# EAGLE design User Interface (EAGLE 8.3.2)
CNAME: KBOT; CREVISION: 2.0; DESIGNER: Y. LABBE & O. LEVEQUE
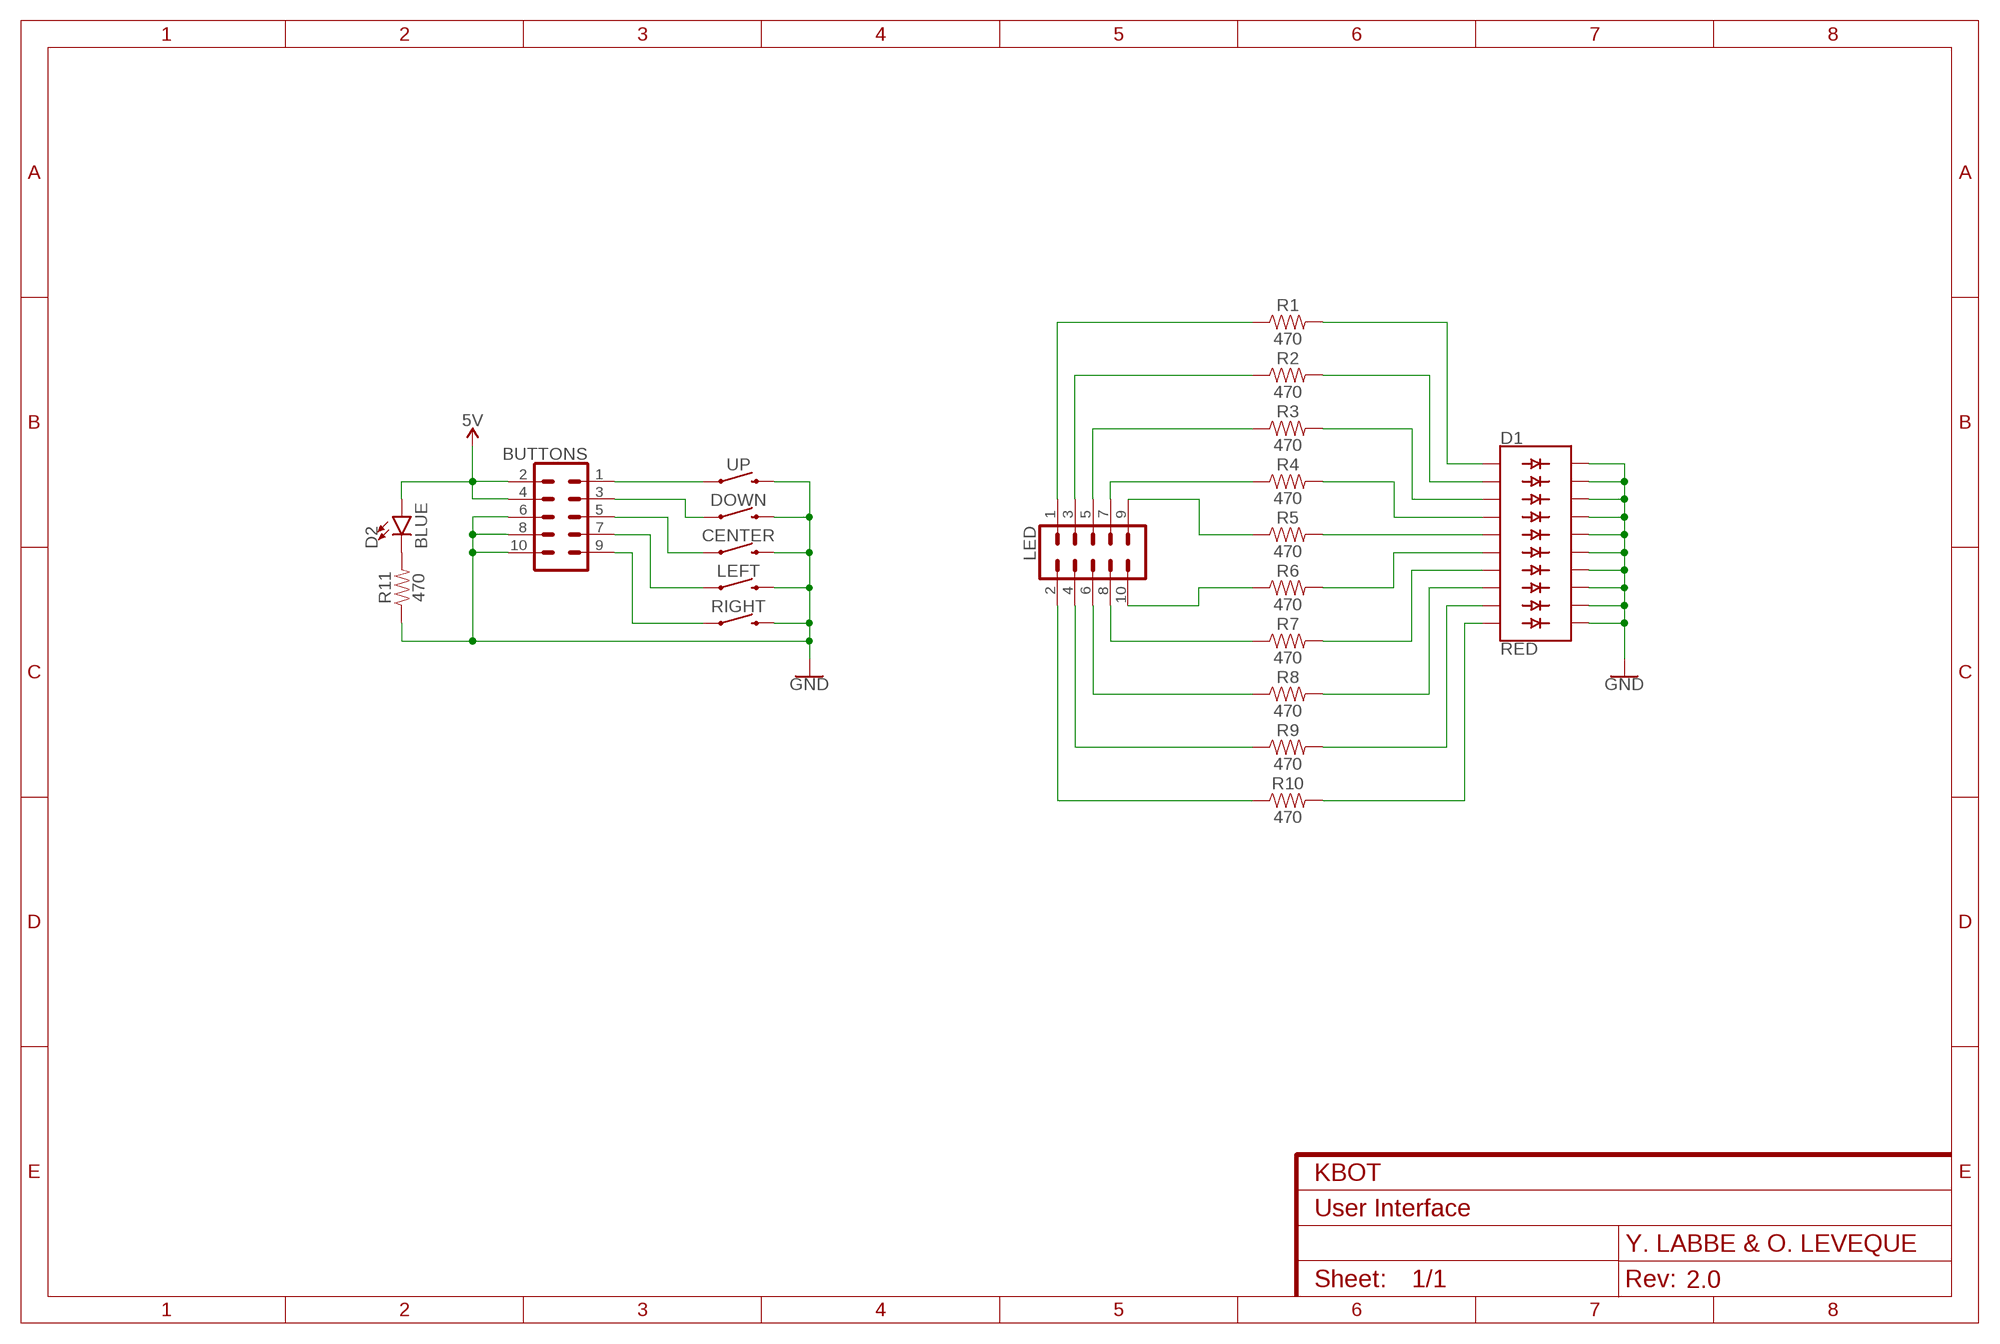
[diagram p0: schematic, sheet 1]

## Parts
BUTTONS  CONN_05X2SHD  [2X5-SHROUDED]
CENTER  MOMENTARY-SWITCH-SPST-PTH-6.0MM  [TACTILE_SWITCH_PTH_6.0MM]
D1  RED  LED_BARGRAPH_10RED  [LED_BARGRAPH_10]
D2  BLUE  LED-BLUE1206  [LED-1206]
DOWN  MOMENTARY-SWITCH-SPST-PTH-6.0MM  [TACTILE_SWITCH_PTH_6.0MM]
LED  CONN_05X2SHD  [2X5-SHROUDED]
LEFT  MOMENTARY-SWITCH-SPST-PTH-6.0MM  [TACTILE_SWITCH_PTH_6.0MM]
R1  470  RESISTOR1206  [1206]
R2  470  RESISTOR1206  [1206]
R3  470  RESISTOR1206  [1206]
R4  470  RESISTOR1206  [1206]
R5  470  RESISTOR1206  [1206]
R6  470  RESISTOR1206  [1206]
R7  470  RESISTOR1206  [1206]
R8  470  RESISTOR1206  [1206]
R9  470  RESISTOR1206  [1206]
R10  470  RESISTOR1206  [1206]
R11  470  RESISTOR1206  [1206]
RIGHT  MOMENTARY-SWITCH-SPST-PTH-6.0MM  [TACTILE_SWITCH_PTH_6.0MM]
UP  MOMENTARY-SWITCH-SPST-PTH-6.0MM  [TACTILE_SWITCH_PTH_6.0MM]

## Nets
5V: BUTTONS.2 BUTTONS.4 D2.A
GND: BUTTONS.6 BUTTONS.8 BUTTONS.10 CENTER.3 D1.11(C9) D1.12(C8) D1.13(C7) D1.14(C6) D1.15(C5) D1.16(C4) D1.17(C3) D1.18(C2) D1.19(C1) D1.20(C) DOWN.3 LEFT.3 R11.1 RIGHT.3 UP.3
N$1: D1.1(A) R1.2
N$2: D1.2(A1) R2.2
N$3: D1.3(A2) R3.2
N$4: D1.4(A3) R4.2
N$5: D1.5(A4) R5.2
N$6: D1.6(A5) R6.2
N$7: D1.7(A6) R7.2
N$8: D1.8(A7) R8.2
N$9: D1.9(A8) R9.2
N$10: D1.10(A9) R10.2
N$11: LED.9 R5.1
N$12: LED.7 R4.1
N$13: LED.5 R3.1
N$14: LED.3 R2.1
N$15: LED.1 R1.1
N$16: LED.10 R6.1
N$17: LED.8 R7.1
N$18: LED.6 R8.1
N$19: LED.4 R9.1
N$20: LED.2 R10.1
N$21: BUTTONS.1 UP.1
N$22: BUTTONS.3 DOWN.1
N$23: BUTTONS.5 CENTER.1
N$24: BUTTONS.7 LEFT.1
N$25: BUTTONS.9 RIGHT.1
N$28: D2.C R11.2

## Library data of the parts
BUTTONS LED = SparkFun-Connectors:CONN_05X2: Multi connection point. Often used as Generic Header-pin footprint for 0.1 inch spaced/style header connections For AVR SPI programming port, see special device with nice symbol: "AVR_SPI_PROG_5x2.dev" You can populate with any combo of single row headers, but if you'd like an exact match, check these: 2x5 AVR ICSP Male Header <https://www.sparkfun.com/products/778> (PRT-00778) 2x5 Pin Shrouded Header <https://www.sparkfun.com/products/8506> (PRT-08506) On any of the 0.1 inch spaced packages, you can populate with these: Break Away Headers - Straight <https://www.sparkfun.com/products/116> (PRT-00116) Break Away Male Headers - Right Angle <https://www.sparkfun.com/products/553> (PRT-00553) Female Headers <https://www.sparkfun.com/products/115> (PRT-00115) Break Away Headers - Machine Pin <https://www.sparkfun.com/products/117> (PRT-00117) Break Away Female Headers - Swiss Machine Pin <https://www.sparkfun.com/products/743> (PRT-00743) Special note: the shrouded connector mates well with our 5x2 ribbon cables: 2x5 Pin IDC Ribbon Cable <https://www.sparkfun.com/products/8535> (PRT-08535); PROD_ID: CONN-08671; SF_ID: PRT-08506
CENTER DOWN LEFT RIGHT UP = SparkFun-Switches:MOMENTARY-SWITCH-SPST: Momentary Switch (Pushbutton) - SPST Normally-open (NO) SPST momentary switches (buttons, pushbuttons). Variants PTH-12MM - 12mm square, through-hole Momentary Pushbutton Switch - 12mm Square <https://www.sparkfun.com/products/9190> (COM-09190) PTH-6.0MM, PTH-6.0MM-KIT - 6.0mm square, through-hole Mini Pushbutton Switch <https://www.sparkfun.com/products/97> (COM-00097) KIT package intended for soldering kit's - only one side of pads' copper is exposed. PTH-RIGHT-ANGLE-KIT - Right-angle, through-hole Right Angle Tactile Button <https://www.sparkfun.com/products/10791> - Used on SparkFun BigTime Watch Kit <https://www.sparkfun.com/products/11734> SMD-12MM - 12mm square, surface-mount Tactile Button - SMD (12mm) <https://www.sparkfun.com/products/12993> (COM-12993) Used on SparkFun PicoBoard <https://www.sparkfun.com/products/11888> SMD-4.5MM - 4.5mm Square Trackball Switch Used on SparkFun Blackberry Trackballer Breakout <https://www.sparkfun.com/products/13169> SMD-4.6MMX2.8MM - 4.60mm x 2.80mm, surface mount Used on SparkFun SAMD21 Mini Breakout <https://www.sparkfun.com/products/13664> SMD-5.2MM, SMD-5.2-REDUNDANT - 5.2mm square, surface-mount Mini Pushbutton Switch - SMD <https://www.sparkfun.com/products/8720> (COM-08720) Used on Arduino Pro Mini <https://www.sparkfun.com/products/11114> REDUNDANT package connects both switch circuits together SMD-6.0X3.5MM - 6.0 x 3.5mm, surface mount Momentary Reset Switch SMD <https://www.sparkfun.com/products/8229> (COM-08229) SMD-6.2MM-TALL - 6.2mm square, surface mount Tactile Button - SMD (6mm) <https://www.sparkfun.com/products/12992> Used on SparkFun Digital Sandbox <https://www.sparkfun.com/products/12651> SMD-RIGHT-ANGLE - Right-angle, surface mount Used on SparkFun Block for Intel® Edison - Arduino <https://www.sparkfun.com/products/13036>; PROD_ID: SWCH-08441; SF_SKU: COM-00097
D1 = SparkFun-LED:LED_BARGRAPH_10: Young Sun LED Tech - YSLB-10251G5-10 10-Segment LED Bar Graph Features: Red Vf = 2.1V, Ifmax = 20mA Yellow Vf = 2.1V, Ifmax = 20mA Blue Vf = 3.4V, Ifmax = 20mA Green Vf = 3.4V, Ifmax = 20mA SparkFun Products: Red <https://www.sparkfun.com/products/9935> Yellow <https://www.sparkfun.com/products/9936> Green <https://www.sparkfun.com/products/9938> Blue <https://www.sparkfun.com/products/9937>; PROD_ID: DIO-10615
D2 = SparkFun-LED:LED-BLUE: Blue SMD LED Used in manufacturing of various products at SparkFun Packages: 0603 - SMD 0603 package [Product Link] <http://www.digikey.com/product-detail/en/SMLE12BC7TT86/511-1589-2-ND/1641808> 1206 - SMD1206 package [Product Link] <http://www.digikey.com/product-detail/en/lite-on-inc/LTST-C150TBKT/160-1643-1-ND/573584> SparkFun Products: ESP8266 Thing-Dev Board <https://www.sparkfun.com/products/13711> RedBoard <https://www.sparkfun.com/products/12757>; PROD_ID: DIO-09911
R1-R11 = SparkFun-Resistors:RESISTOR: Generic Resistor Package

## Board
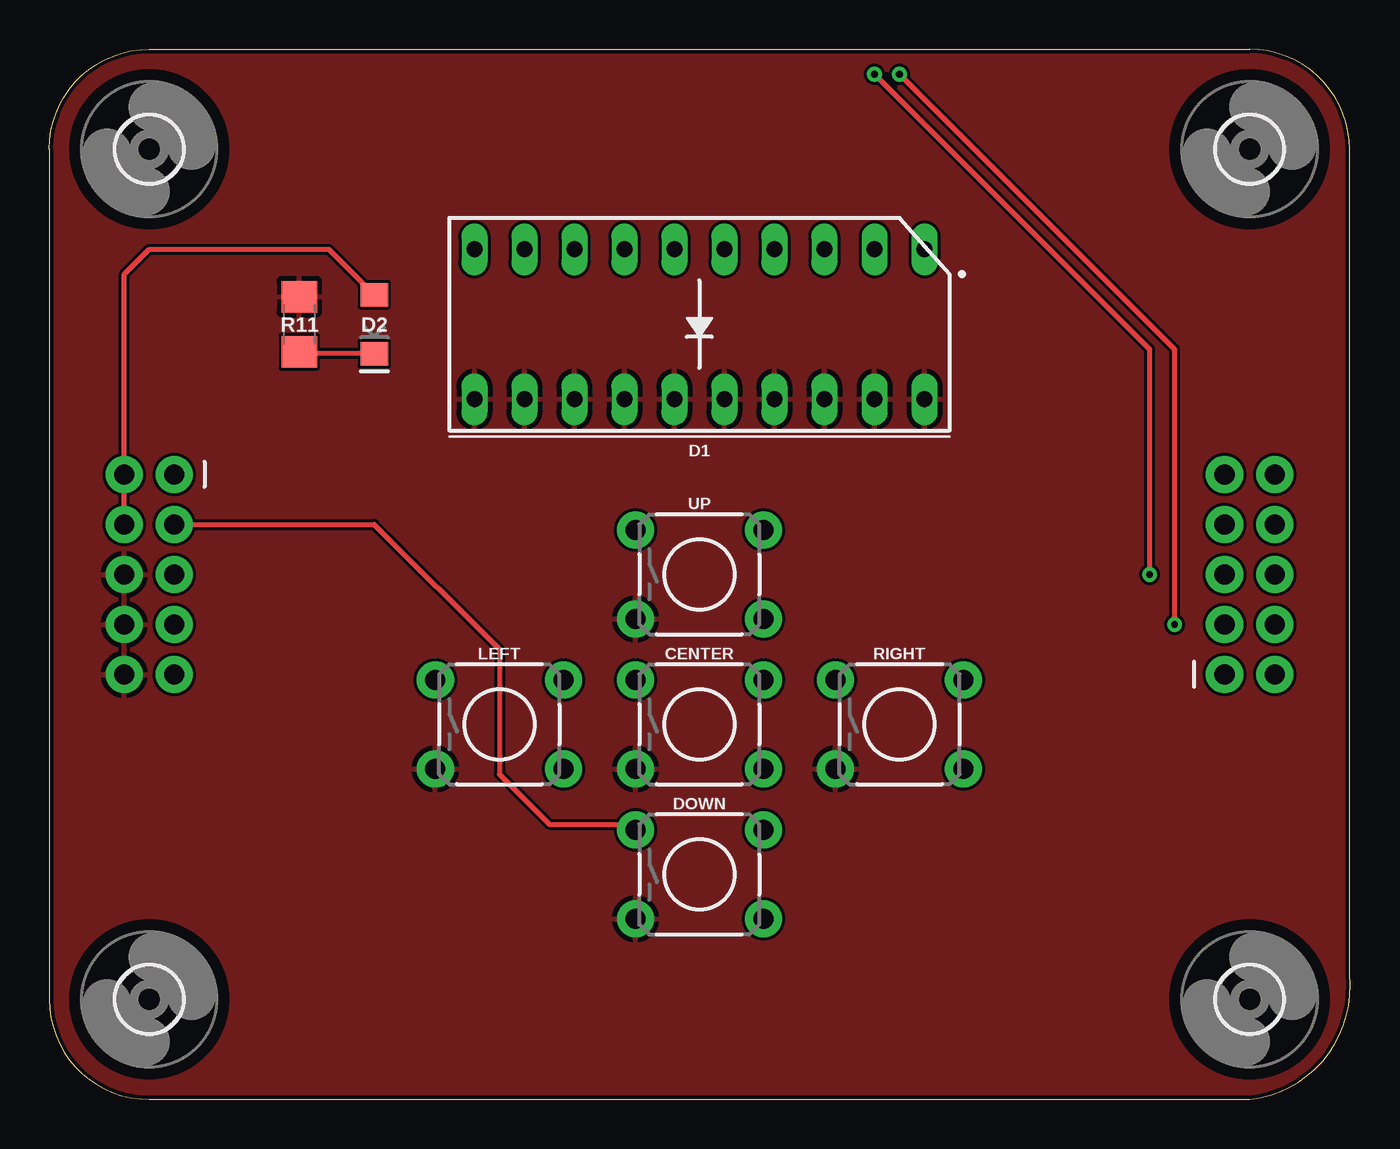
[diagram p1: board, top side]
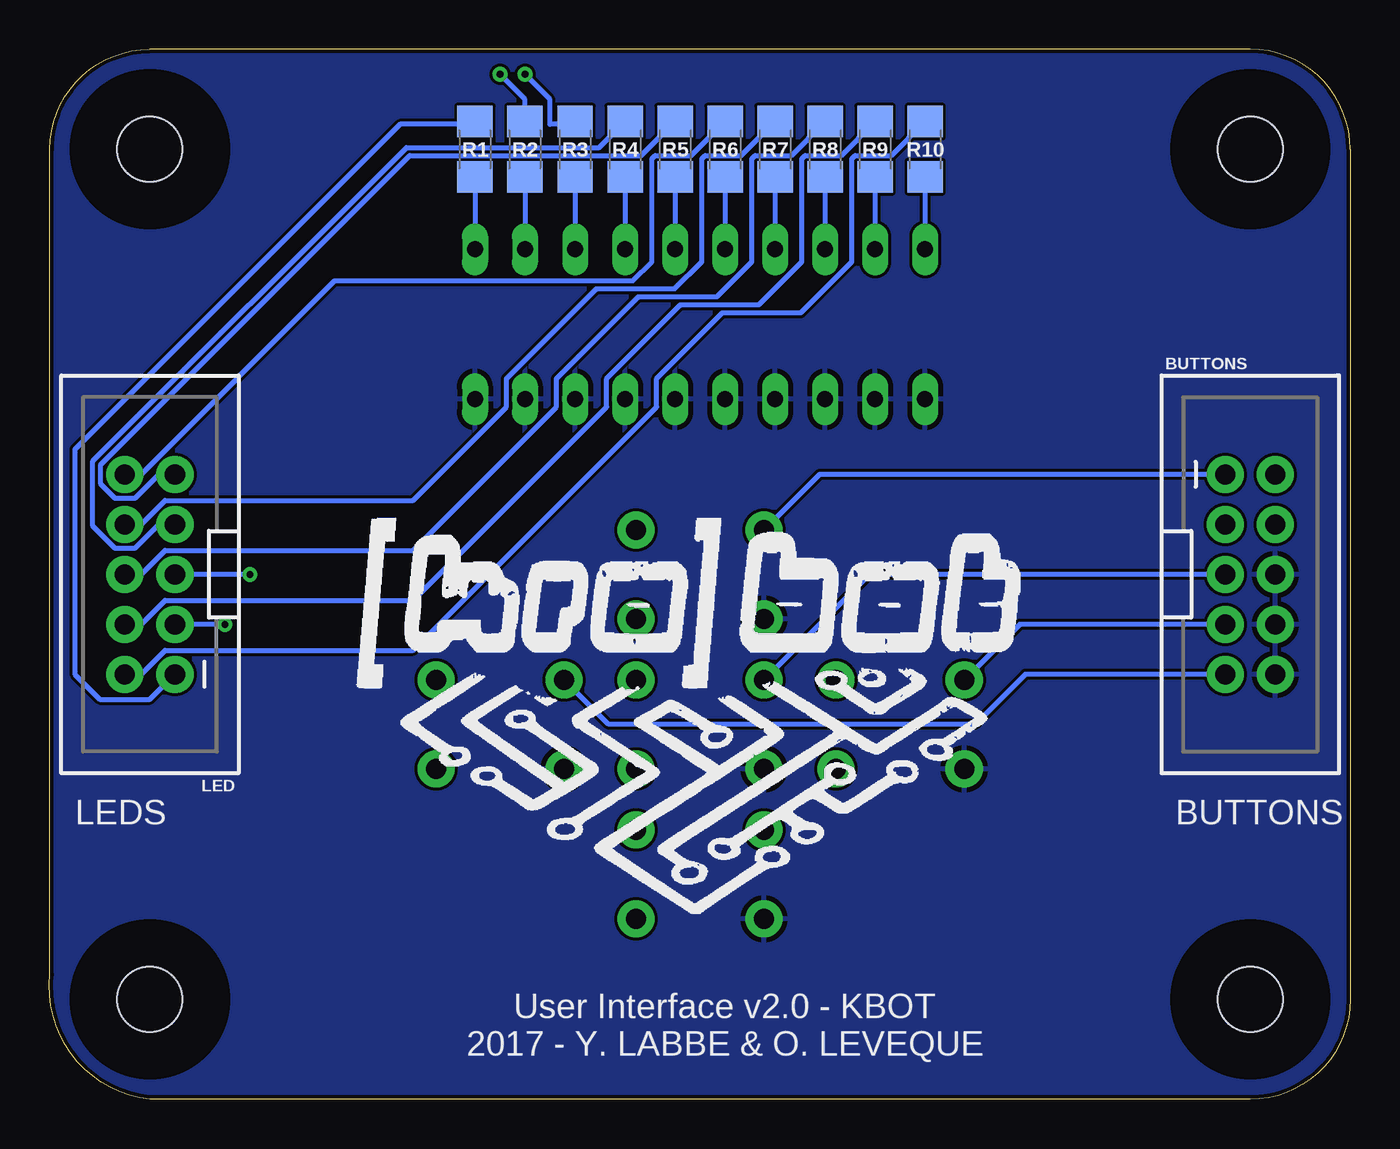
[diagram p2: board, bottom side, seen from below]

Size 66.07 x 53.34 mm. Coordinates in mm from the lower left corner, seen from the top.
Outline: 5.08,0 60.96,0 arc90 66.04,6.35 66.04,48.26 arc90 60.96,53.34 5.08,53.34 arc90 0,48.26 0,5.08 arc90 5.08,0
Copper layers (1*16): Top 0.035mm / dielectric 1.5mm / Bottom 0.035mm
Design rules "default *": minimum track width 6mil, minimum drill 12mil, track to track 6mil, track to pad 6mil, pad to pad 6mil, via to via 6mil, smd to smd 6mil, copper to edge 8mil, drill to drill 6mil, minimum pad ring 10mil, minimum via ring 8mil, stop-mask expansion 4mil, vias tented up to drill 0mil, thermal gap 10mil

### Footprints (pad centres in the part's own frame; a part is rotated, then mirrored left to right if it is on the bottom)
2X5-SHROUDED = drill 1.016 pad 1.88: 1 -1.27,5.08; 2 1.27,5.08; 3 -1.27,2.54; 4 1.27,2.54; 5 -1.27,0; 6 1.27,0; 7 -1.27,-2.54; 8 1.27,-2.54; 9 -1.27,-5.08; 10 1.27,-5.08
TACTILE_SWITCH_PTH_6.0MM = drill 1.016 pad 1.88: 1 -3.251,2.261; 2 3.251,2.261; 3 -3.251,-2.261; 4 3.251,-2.261
LED_BARGRAPH_10 = drill 0.813 long: 1 -11.43,-3.81; 2 -8.89,-3.81; 3 -6.35,-3.81; 4 -3.81,-3.81; 5 -1.27,-3.81; 6 1.27,-3.81; 7 3.81,-3.81; 8 6.35,-3.81; 9 8.89,-3.81; 10 11.43,-3.81; 11 11.43,3.81; 12 8.89,3.81; 13 6.35,3.81; 14 3.81,3.81; 15 1.27,3.81; 16 -1.27,3.81; 17 -3.81,3.81; 18 -6.35,3.81; 19 -8.89,3.81; 20 -11.43,3.81
LED-1206 = smd 1.2 x 1.4: A -1.5,0; C 1.5,0
1206 = smd 1.6 x 1.8: 1 -1.4,0; 2 1.4,0
3,3 = hole 3.3: 0,0

### Placement (x,y rotation side)
BUTTONS  5.08,26.67 0 bottom
CENTER  33.02,19.05 0 top
D1  33.02,39.37 180 top
D2  16.51,39.37 270 top
DOWN  33.02,11.43 0 top
LED  60.96,26.67 180 bottom
LEFT  22.86,19.05 0 top
R1  44.45,48.26 270 bottom
R2  41.91,48.26 270 bottom
R3  39.37,48.26 270 bottom
R4  36.83,48.26 270 bottom
R5  34.29,48.26 270 bottom
R6  31.75,48.26 270 bottom
R7  29.21,48.26 270 bottom
R8  26.67,48.26 270 bottom
R9  24.13,48.26 270 bottom
R10  21.59,48.26 270 bottom
R11  12.7,39.37 270 top
RIGHT  43.18,19.05 0 top
U$1  [3,3]  5.08,5.08 0 top
U$2  [3,3]  60.96,5.08 0 top
U$3  [3,3]  5.08,48.26 0 top
U$4  [3,3]  60.96,48.26 0 top
U$5  [LOGO_33MM]  33.02,20.32 0 bottom
UP  33.02,26.67 0 top

### Tracks (layer width: path | path; a pad name or v marks a point on that pad's centre or on a via)
5V
  Top 0.254: BUTTONS.4 BUTTONS.2 3.81,41.91 5.08,43.18 14.2,43.18 D2.A
GND
  pour Top: 0,0 0,53.34 66.04,53.34 66.04,0
  pour Bottom: 0,0 0,53.34 66.04,53.34 66.04,0
N$1
  Bottom 0.254: R1.2 D1.1
N$2
  Bottom 0.254: R2.2 D1.2
N$3
  Bottom 0.254: R3.2 D1.3
N$4
  Bottom 0.254: R4.2 D1.4
N$5
  Bottom 0.254: R5.2 D1.5
N$6
  Bottom 0.254: R6.2 D1.6
N$7
  Bottom 0.254: R7.2 D1.7
N$8
  Bottom 0.254: R8.2 D1.8
N$9
  Bottom 0.254: R9.2 D1.9
N$10
  Bottom 0.254: R10.2 D1.10
N$11
  Bottom 0.254: R5.1 36.01,47.94 47.77,47.94 63.45,32.26 63.45,31.25 62.73,30.53 61.73,30.53 60.51,31.75 LED.9
N$12
  Bottom 0.254: R4.1 38.14,48.35 47.93,48.35 63.86,32.42 63.86,29.11 62.73,27.99 61.73,27.99 60.51,29.21 LED.7
N$13  (via drill 0.35)
  Top 0.254: v55.88,26.67 55.88,38.1 v41.91,52.07
  Bottom 0.254: v55.88,26.67 LED.5 | v41.91,52.07 40.64,50.8 40.64,49.53 39.37,49.53 R3.1
N$14  (via drill 0.35)
  Top 0.254: v57.15,24.13 57.15,38.1 v43.18,52.07
  Bottom 0.254: v57.15,24.13 LED.3 | v43.18,52.07 41.91,50.8 R2.1 41.91,49.53
N$15
  Bottom 0.254: LED.1 60.96,20.32 63.5,20.32 64.77,21.59 64.77,33.02 48.26,49.53 44.45,49.53 R1.1
N$16
  Bottom 0.254: R6.1 33.47,47.94 35.31,47.94 35.47,47.78 35.47,42.55 36.44,41.58 51.58,41.58 61.41,31.75 LED.10
N$17
  Bottom 0.254: R7.1 30.93,47.94 32.77,47.94 32.93,47.78 32.93,42.55 34.31,41.17 38.29,41.17 42.85,36.61 42.85,35.17 47.59,30.43 60.2,30.43 61.41,29.21 LED.8
N$18
  Bottom 0.254: R8.1 28.39,47.94 30.23,47.94 30.39,47.78 30.39,42.55 32.17,40.77 36.15,40.77 40.31,36.61 40.31,35.17 47.59,27.89 60.2,27.89 61.41,26.67 LED.6
N$19
  Bottom 0.254: R9.1 25.85,47.94 27.69,47.94 27.85,47.78 27.85,42.55 30.04,40.36 34.02,40.36 37.77,36.61 37.77,35.17 47.59,25.35 60.2,25.35 61.41,24.13 LED.4
N$20
  Bottom 0.254: R10.1 23.31,47.94 25.15,47.94 25.31,47.78 25.31,42.55 27.91,39.95 31.89,39.95 35.23,36.61 35.23,35.17 47.59,22.81 60.2,22.81 61.41,21.59 LED.2
N$21
  Bottom 0.254: BUTTONS.1 26.95,31.75 UP.1
N$22
  Top 0.254: BUTTONS.3 16.51,29.21 22.86,22.86 22.86,16.51 25.4,13.97 29.49,13.97 DOWN.1
N$23
  Bottom 0.254: BUTTONS.5 24.41,26.67 CENTER.1
N$24
  Bottom 0.254: BUTTONS.7 16.79,24.13 LEFT.1
N$25
  Bottom 0.254: BUTTONS.9 16.51,21.59 19.05,19.05 37.67,19.05 RIGHT.1
N$28
  Top 0.254: D2.C 12.8,37.87 R11.2

### Text on the board
bPlace: BUTTONS | LEDS | User Interface v2.0 - KBOT / 2017 - Y. LABBE & O. LEVEQUE